# Altium schematic sheet MainBoard_USB.SchDoc
size B
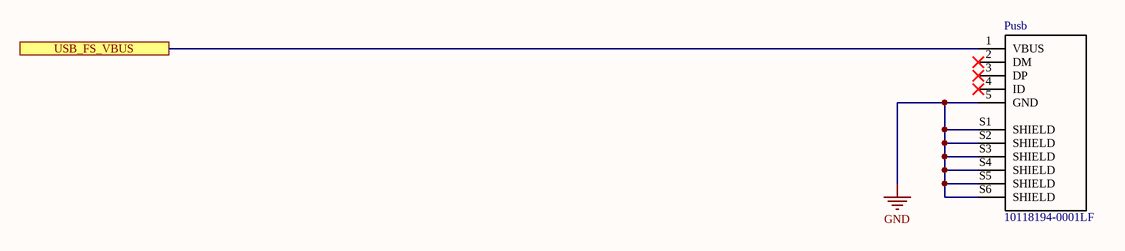
[diagram p0: MainBoard_USB.SchDoc]

## Parts
Pusb  10118194-0001LF  [USB Micro B Receptacle]

## Ports
USB_FS_VBUS

## Nets
GND: Pusb.5(GND) Pusb.S1(SHIELD) Pusb.S2(SHIELD) Pusb.S3(SHIELD) Pusb.S4(SHIELD) Pusb.S5(SHIELD) Pusb.S6(SHIELD)
USB_FS_VBUS: Pusb.1(VBUS) ; port USB_FS_VBUS

Not connected (* = marked no-connect by the designer): Pusb 2(DM)* 3(DP)* 4(ID)*

## Library data of the parts
Pusb = USB Micro B Receptacle: USB - micro B USB 2.0 Receptacle Connector 5 Position Surface Mount, Right Angle; Through Hole; MF: Amphenol ICC (FCI); Rating: 100VAC 1.8A; Digikey: 609-4618-1-ND; Digikey Link: https://www.digikey.ca/product-detail/en/amphenol-icc-fci/10118194-0001LF/609-4618-1-ND/2785382; MP: 10118194-0001LF; Price: 0.62000 CAD; ComponentLink1Description: Digikey; ComponentLink1URL: https://www.digikey.ca/product-detail/en/amphenol-icc-fci/10118194-0001LF/609-4618-1-ND/2785382; ComponentLink2Description: Datasheet; ComponentLink2URL: https://www.digikey.ca/en/datasheets/amphenol-fci/amphenol-fci-io-usb-micro